# EAGLE design PCB SRCA (EAGLE 9.6.2)

## Sheet 1 of 3
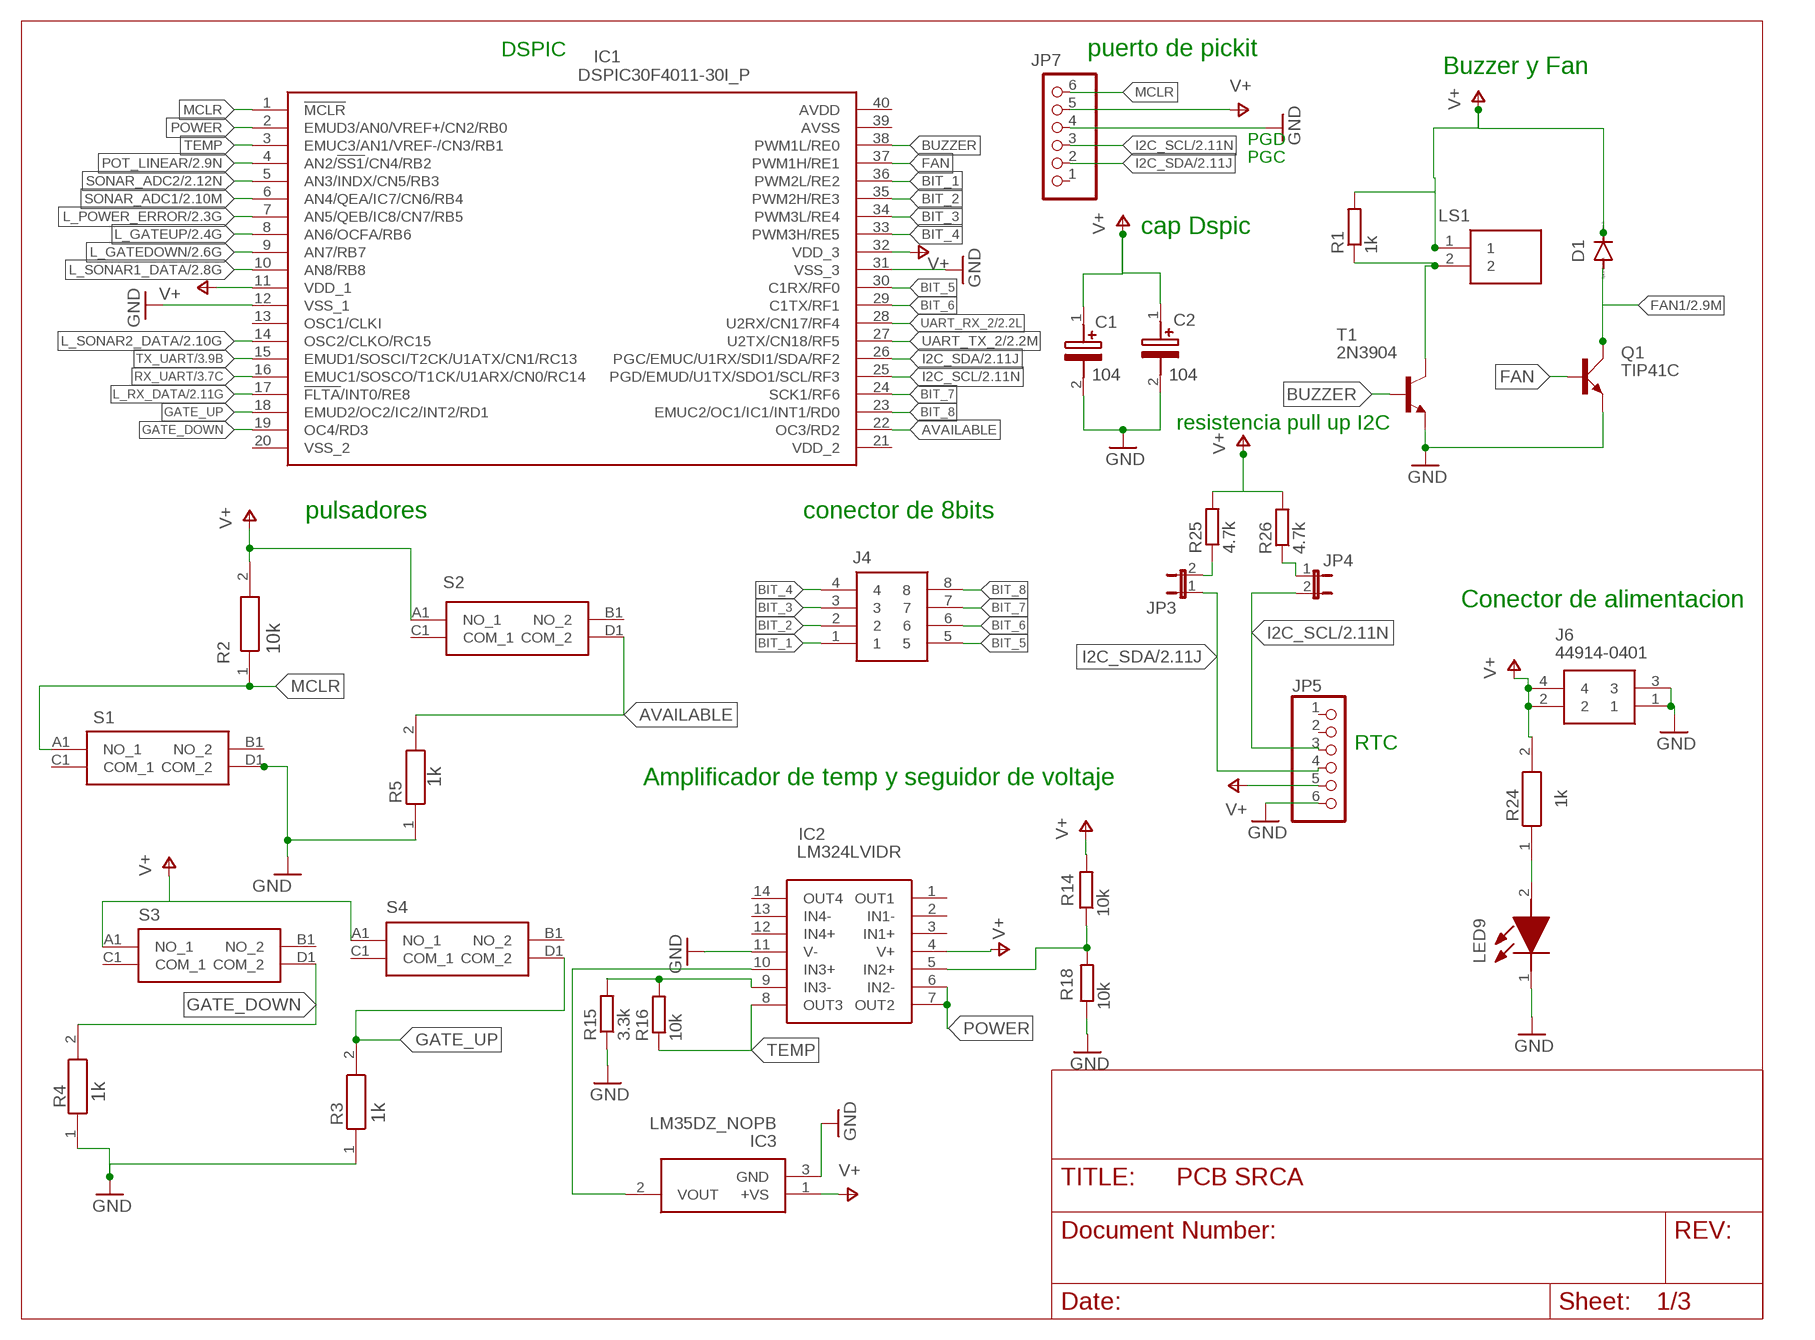
[diagram p0: schematic, sheet 1]

### Parts
C1  TAJR104K020RNJ  [CAPPM2014X120N]
C2  TAJR104K020RNJ  [CAPPM2014X120N]
D1  1N4148DO35-7  [DO35-7]
IC1  DSPIC30F4011-30I_P  [DIP1543W58P254L5175H635Q40N]
IC2  LM324LVIDR  [SOIC127P600X175-14N]
IC3  LM35DZ_NOPB  [LP0003A]
J4  44914-0801  [44914-0801]
J6  44914-0401  [44914-0401]
JP3  JP1E  [JP1]
JP4  JP1E  [JP1]
JP5  PINHD-1X6  [1X06]
JP7  PINHD-1X6  [1X06]
LED9  599-0181-007F  [LEDC2012X70N]
LS1  PS1240P02BT  [PS1240P02BT]
Q1  TIP41C  [TO220AV]
R1  1k  R-EU_0207/10  [0207/10]
R2  RC0805FR-071KL  [RESC2012X60N]
R3  RC0805FR-071KL  [RESC2012X60N]
R4  RC0805FR-071KL  [RESC2012X60N]
R5  RC0805FR-071KL  [RESC2012X60N]
R14  10k  R-EU_0207/10  [0207/10]
R15  3.3k  R-EU_0207/10  [0207/10]
R16  10k  R-EU_0207/10  [0207/10]
R18  10k  R-EU_0207/10  [0207/10]
R24  RC0805FR-071KL  [RESC2012X60N]
R25  4.7k  R-EU_0207/10  [0207/10]
R26  4.7k  R-EU_0207/10  [0207/10]
S1  PTS645SK50JSMTR92_LFS  [PTS645SK50JSMTR92LFS]
S2  PTS645SK50JSMTR92_LFS  [PTS645SK50JSMTR92LFS]
S3  PTS645SK50JSMTR92_LFS  [PTS645SK50JSMTR92LFS]
S4  PTS645SK50JSMTR92_LFS  [PTS645SK50JSMTR92LFS]
T1  2N3904  [TO92]

### Nets
AVAILABLE: IC1.22(OC3/RD2) R5.2 S2.D1(COM_2)
BIT_1: IC1.36(PWM2L/RE2) J4.1
BIT_2: IC1.35(PWM2H/RE3) J4.2
BIT_3: IC1.34(PWM3L/RE4) J4.3
BIT_4: IC1.33(PWM3H/RE5) J4.4
BIT_5: IC1.30(C1RX/RF0) J4.5
BIT_6: IC1.29(C1TX/RF1) J4.6
BIT_7: IC1.24(SCK1/RF6) J4.7
BIT_8: IC1.23(EMUC2/OC1/IC1/INT1/RD0) J4.8
BUZZER: IC1.38(PWM1L/RE0) T1.2(B)
FAN: IC1.37(PWM1H/RE1) Q1.B
FAN1: D1.A Q1.C ; also sheet 2
GATE_DOWN: IC1.19(OC4/RD3) R4.2 S3.D1(COM_2)
GATE_UP: IC1.18(EMUD2/OC2/IC2/INT2/RD1) R3.2 S4.D1(COM_2)
GND: C1.2(-) C2.2(-) IC1.12(VSS_1) IC1.31(VSS_3) IC2.11(V-) IC3.3(GND) J6.1 J6.3 JP5.6 JP7.4 LED9.1(K) Q1.E R3.1 R4.1 R5.1 R15.1 R18.1 S1.D1(COM_2) T1.3(E) ; also sheet 2,3
I2C_SCL: IC1.25(PGD/EMUD/U1TX/SDO1/SCL/RF3) JP4.2 JP5.3 JP7.3 ; also sheet 2
I2C_SDA: IC1.26(PGC/EMUC/U1RX/SDI1/SDA/RF2) JP3.1 JP5.4 JP7.2 ; also sheet 2
L_GATEDOWN: IC1.9(AN7/RB7) ; also sheet 2
L_GATEUP: IC1.8(AN6/OCFA/RB6) ; also sheet 2
L_POWER_ERROR: IC1.7(AN5/QEB/IC8/CN7/RB5) ; also sheet 2
L_RX_DATA: IC1.17(!FLTA!/INT0/RE8) ; also sheet 2
L_SONAR1_DATA: IC1.10(AN8/RB8) ; also sheet 2
L_SONAR2_DATA: IC1.14(OSC2/CLKO/RC15) ; also sheet 2
MCLR: IC1.1(!MCLR) JP7.6 R2.1 S1.A1(NO_1)
N$1: IC2.9(IN3-) R15.2 R16.2
N$14: IC2.10(IN3+) IC3.2(VOUT)
N$19: JP3.2 R25.1
N$25: LS1.2 R1.1 T1.1(C)
N$28: LED9.2(A) R24.1
N$31: JP4.1 R26.1
N$32: IC2.5(IN2+) R14.1 R18.2
POT_LINEAR: IC1.4(AN2/!SS1!/CN4/RB2) ; also sheet 2
POWER: IC1.2(EMUD3/AN0/VREF+/CN2/RB0) IC2.6(IN2-) IC2.7(OUT2)
RX_UART: IC1.16(EMUC1/SOSCO/T1CK/U1ARX/CN0/RC14) ; also sheet 3
SONAR_ADC1: IC1.6(AN4/QEA/IC7/CN6/RB4) ; also sheet 2
SONAR_ADC2: IC1.5(AN3/INDX/CN5/RB3) ; also sheet 2
TEMP: IC1.3(EMUC3/AN1/VREF-/CN3/RB1) IC2.8(OUT3) R16.1
TX_UART: IC1.15(EMUD1/SOSCI/T2CK/U1ATX/CN1/RC13) ; also sheet 3
UART_RX_2: IC1.28(U2RX/CN17/RF4) ; also sheet 2
UART_TX_2: IC1.27(U2TX/CN18/RF5) ; also sheet 2
V+: C1.1(+) C2.1(+) D1.C IC1.11(VDD_1) IC1.32(VDD_3) IC2.4(V+) IC3.1(+VS) J6.2 J6.4 JP5.5 JP7.5 LS1.1 R1.2 R2.2 R14.2 R24.2 R25.2 R26.2 S2.A1(NO_1) S3.A1(NO_1) S4.A1(NO_1) ; also sheet 2,3
Unconnected: IC1.13(OSC1/CLKI) IC1.20(VSS_2) IC1.21(VDD_2) IC1.39(AVSS) IC1.40(AVDD) IC2.1(OUT1) IC2.2(IN1-) IC2.3(IN1+) IC2.12(IN4+) IC2.13(IN4-) IC2.14(OUT4) JP5.1 JP5.2 JP7.1 S1.B1(NO_2) S1.C1(COM_1) S2.B1(NO_2) S2.C1(COM_1) S3.B1(NO_2) S3.C1(COM_1) S4.B1(NO_2) S4.C1(COM_1)

### Notes on the sheet
- DSPIC | puerto de pickit
- Buzzer y Fan
- PGD
- PGC
- cap Dspic
- 104 | 104
- resistencia pull up I2C
- pulsadores | conector de 8bits
- Conector de alimentacion
- 10k
- RTC
- 1k | Amplificador de temp y seguidor de voltaje
- 1k
- 1k
- 1k

## Sheet 2 of 3
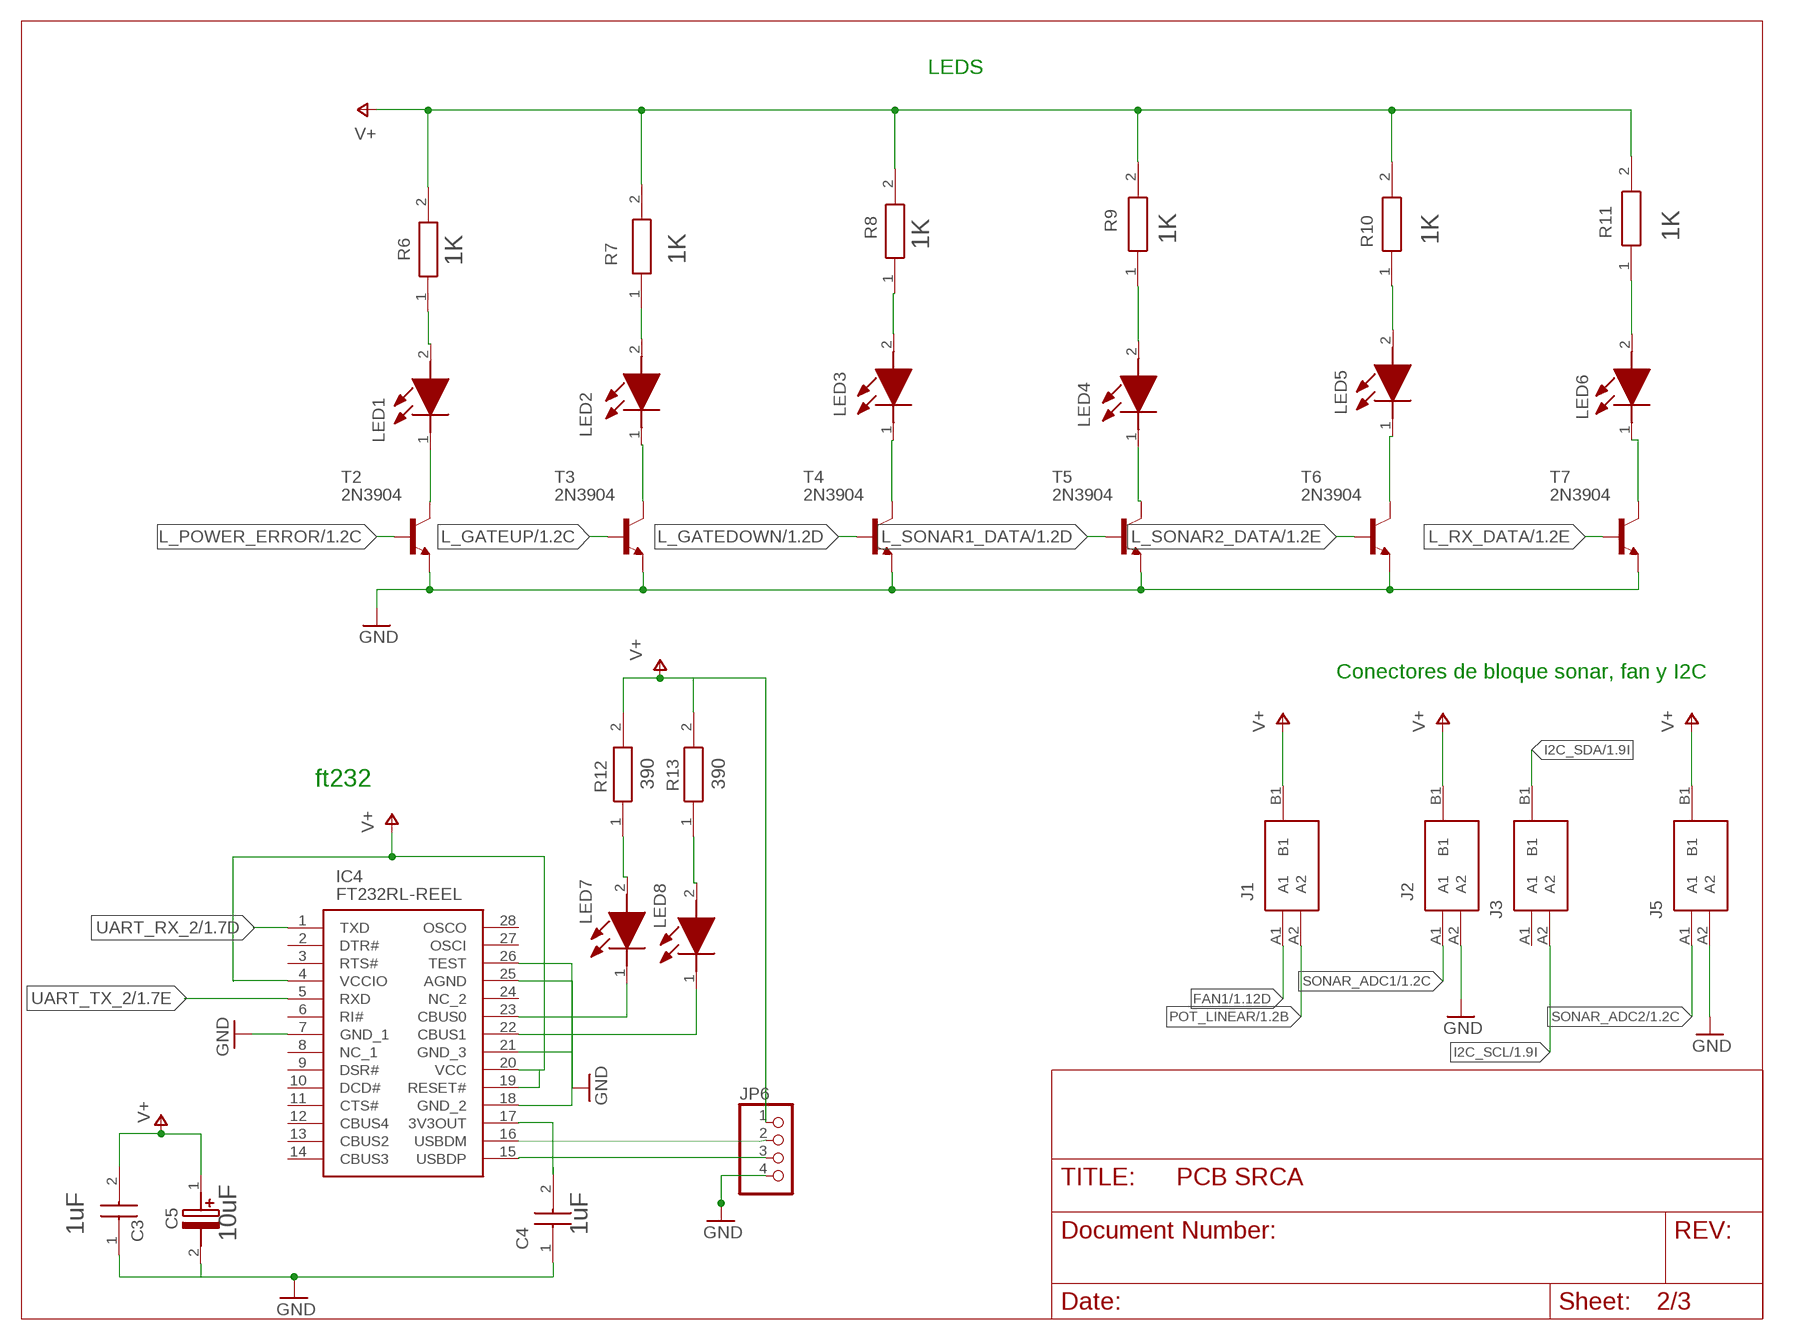
[diagram p1: schematic, sheet 2]

### Parts
C3  C0805X104K1RAC3316  [CAPC2012X100N]
C4  C0805X104K1RAC3316  [CAPC2012X100N]
C5  UUP1C100MCL1GS  [CAPAE530X610N]
IC4  FT232RL-REEL  [SOP65P778X200-28N]
J1  TBL002A-350-03GR-2OR  [TBL002A35003GR2OR]
J2  TBL002A-350-03GR-2OR  [TBL002A35003GR2OR]
J3  TBL002A-350-03GR-2OR  [TBL002A35003GR2OR]
J5  TBL002A-350-03GR-2OR  [TBL002A35003GR2OR]
JP6  PINHD-1X4  [1X04]
LED1  599-0181-007F  [LEDC2012X70N]
LED2  599-0181-007F  [LEDC2012X70N]
LED3  599-0181-007F  [LEDC2012X70N]
LED4  599-0181-007F  [LEDC2012X70N]
LED5  599-0181-007F  [LEDC2012X70N]
LED6  599-0181-007F  [LEDC2012X70N]
LED7  599-0181-007F  [LEDC2012X70N]
LED8  599-0181-007F  [LEDC2012X70N]
R6  RC0805FR-071KL  [RESC2012X60N]
R7  RC0805FR-071KL  [RESC2012X60N]
R8  RC0805FR-071KL  [RESC2012X60N]
R9  RC0805FR-071KL  [RESC2012X60N]
R10  RC0805FR-071KL  [RESC2012X60N]
R11  RC0805FR-071KL  [RESC2012X60N]
R12  RC0805FR-071KL  [RESC2012X60N]
R13  RC0805FR-071KL  [RESC2012X60N]
T2  2N3904  [TO92]
T3  2N3904  [TO92]
T4  2N3904  [TO92]
T5  2N3904  [TO92]
T6  2N3904  [TO92]
T7  2N3904  [TO92]

### Nets
FAN1: J1.A1 ; also sheet 1
GND: C3.1 C4.1 C5.2(-) IC4.7(GND_1) IC4.18(GND_2) IC4.21(GND_3) IC4.25(AGND) IC4.26(TEST) J2.A2 J5.A2 JP6.4 T2.3(E) T3.3(E) T4.3(E) T5.3(E) T6.3(E) T7.3(E) ; also sheet 1,3
I2C_SCL: J3.A2 ; also sheet 1
I2C_SDA: J3.B1 ; also sheet 1
L_GATEDOWN: T4.2(B) ; also sheet 1
L_GATEUP: T3.2(B) ; also sheet 1
L_POWER_ERROR: T2.2(B) ; also sheet 1
L_RX_DATA: T7.2(B) ; also sheet 1
L_SONAR1_DATA: T5.2(B) ; also sheet 1
L_SONAR2_DATA: T6.2(B) ; also sheet 1
N$2: LED1.2(A) R6.1
N$3: IC4.23(CBUS0) LED7.1(K)
N$4: LED1.1(K) T2.1(C)
N$5: LED2.2(A) R7.1
N$6: LED2.1(K) T3.1(C)
N$7: LED3.1(K) T4.1(C)
N$8: LED4.2(A) R9.1
N$9: LED5.2(A) R10.1
N$10: LED3.2(A) R8.1
N$11: LED4.1(K) T5.1(C)
N$12: LED6.2(A) R11.1
N$13: LED7.2(A) R12.1
N$15: LED8.2(A) R13.1
N$16: LED5.1(K) T6.1(C)
N$17: LED6.1(K) T7.1(C)
N$18: IC4.22(CBUS1) LED8.1(K)
N$20: C4.2 IC4.17(3V3OUT)
N$21: IC4.16(USBDM) JP6.2
N$22: IC4.15(USBDP) JP6.3
POT_LINEAR: J1.A2 ; also sheet 1
SONAR_ADC1: J2.A1 ; also sheet 1
SONAR_ADC2: J5.A1 ; also sheet 1
UART_RX_2: IC4.1(TXD) ; also sheet 1
UART_TX_2: IC4.5(RXD) ; also sheet 1
V+: C3.2 C5.1(+) IC4.4(VCCIO) IC4.19(RESET#) IC4.20(VCC) J1.B1 J2.B1 J5.B1 JP6.1 R6.2 R7.2 R8.2 R9.2 R10.2 R11.2 R12.2 R13.2 ; also sheet 1,3
Unconnected: IC4.2(DTR#) IC4.3(RTS#) IC4.6(RI#) IC4.8(NC_1) IC4.9(DSR#) IC4.10(DCD#) IC4.11(CTS#) IC4.12(CBUS4) IC4.13(CBUS2) IC4.14(CBUS3) IC4.24(NC_2) IC4.27(OSCI) IC4.28(OSCO) J3.A1

### Notes on the sheet
- LEDS
- 1K | 1K | 1K
- 1K
- 1K | 1K
- Conectores de bloque sonar, fan y I2C
- ft232 | 390 | 390
- 1uF | 10uF | 1uF

## Sheet 3 of 3
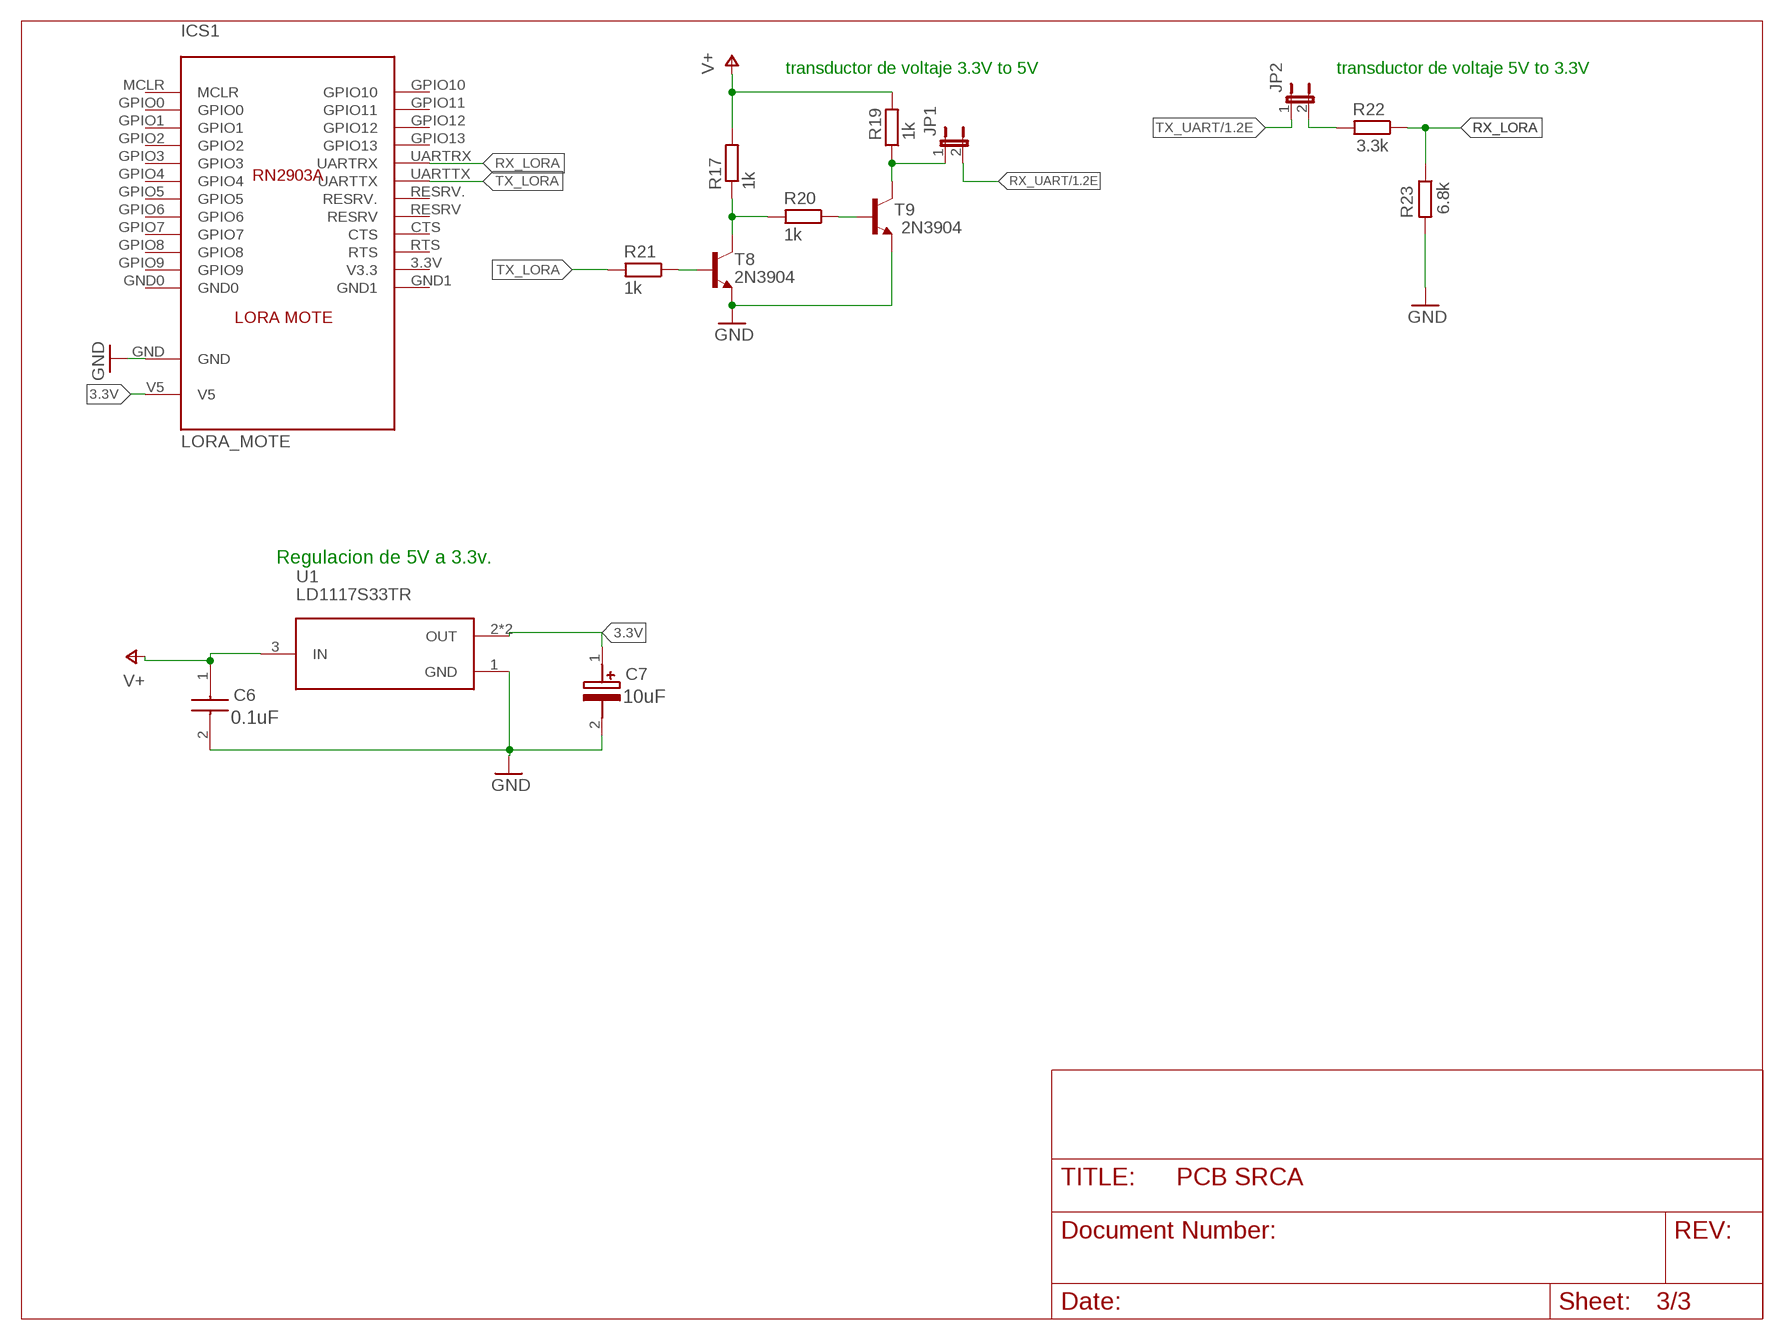
[diagram p2: schematic, sheet 3]

### Parts
C6  C0805X104K1RAC3316  [CAPC2012X100N]
C7  UUP1C100MCL1GS  [CAPAE530X610N]
ICS1  LORA_MOTE  [LORA_MOTE_RN2903]
JP1  JP1E  [JP1]
JP2  JP1E  [JP1]
R17  1k  R-EU_0207/10  [0207/10]
R19  1k  R-EU_0207/10  [0207/10]
R20  1k  R-EU_0207/10  [0207/10]
R21  1k  R-EU_0207/10  [0207/10]
R22  3.3k  R-EU_0207/10  [0207/10]
R23  6.8k  R-EU_0207/10  [0207/10]
T8  2N3904  [TO92]
T9  2N3904  [TO92]
U1  LD1117S33TR  [SOT230P700X180-4N]

### Nets
3.3V: C7.1(+) ICS1.V5 U1.2(OUT) U1.4(OUT)
GND: C6.2 C7.2(-) ICS1.GND R23.2 T8.3(E) T9.3(E) U1.1(GND) ; also sheet 1,2
N$23: R17.1 R20.2 T8.1(C)
N$24: R21.1 T8.2(B)
N$26: R20.1 T9.2(B)
N$27: JP2.2 R22.2
N$30: JP1.1 R19.1 T9.1(C)
RX_LORA: ICS1.UARTRX R22.1 R23.1
RX_UART: JP1.2 ; also sheet 1
TX_LORA: ICS1.UARTTX R21.2
TX_UART: JP2.1 ; also sheet 1
V+: C6.1 R17.2 R19.2 U1.3(IN) ; also sheet 1,2
Unconnected: ICS1.3.3V(V3.3) ICS1.CTS ICS1.GND0 ICS1.GND1 ICS1.GPIO0 ICS1.GPIO1 ICS1.GPIO2 ICS1.GPIO3 ICS1.GPIO4 ICS1.GPIO5 ICS1.GPIO6 ICS1.GPIO7 ICS1.GPIO8 ICS1.GPIO9 ICS1.GPIO10 ICS1.GPIO11 ICS1.GPIO12 ICS1.GPIO13 ICS1.MCLR ICS1.RESRV ICS1.RESRV. ICS1.RTS

### Notes on the sheet
- transductor de voltaje 3.3V to 5V | transductor de voltaje 5V to 3.3V
- Regulacion de 5V a 3.3v.
- 10uF
- 0.1uF

## Library data of the parts
C1 C2 = TAJR104K020RNJ:TAJR104K020RNJ: TAJ smt tant capacitor,case R,0.1uF,20V AVX 100nF SMD Solid MnO2 Tantalum Electrolytic Capacitor, 20 V dc +/-10%, TAJ Series Source: Datasheet; DESCRIPTION: TAJ smt tant capacitor,case R,0.1uF,20V AVX 100nF SMD Solid MnO2 Tantalum Electrolytic Capacitor, 20 V dc +/-10%, TAJ Series; HEIGHT: 1.2mm; MANUFACTURER_NAME: AVX; MANUFACTURER_PART_NUMBER: TAJR104K020RNJ; MOUSER_PART_NUMBER: 581-TAJR104K020R; MOUSER_PRICE-STOCK: https://www.mouser.co.uk/ProductDetail/AVX/TAJR104K020RNJ?qs=4whTb%2F0XQMhML1Gq%2FTLBlg%3D%3D
C3 C4 C6 = C0805X104K1RAC3316:C0805X104K1RAC3316: Multilayer Ceramic Capacitors MLCC - SMD/SMT 100V .1uF X7R AUTO 5mm Flex VW80808 Source: Datasheet <https://api.kemet.com/component-edge/download/datasheet/C0805X104K1RAC3316.pdf>; DESCRIPTION: Multilayer Ceramic Capacitors MLCC - SMD/SMT 100V .1uF X7R AUTO 5mm Flex VW80808; HEIGHT: 1mm; MANUFACTURER_NAME: Kemet; MANUFACTURER_PART_NUMBER: C0805X104K1RAC3316; MOUSER_PART_NUMBER: 80-C0805X104K1R3316; MOUSER_PRICE-STOCK: https://www.mouser.co.uk/ProductDetail/KEMET/C0805X104K1RAC3316/?qs=l7cgNqFNU1gwaeaoie4AnQ%3D%3D
C5 C7 = UUP1C100MCL1GS:UUP1C100MCL1GS: Aluminum Electrolytic Capacitors - SMD 16volts 10uF AEC-Q200 Source: Datasheet <https://componentsearchengine.com/Datasheets/1/UUP1C100MCL1GS.pdf>; DESCRIPTION: Aluminum Electrolytic Capacitors - SMD 16volts 10uF AEC-Q200; HEIGHT: 6.1mm; MANUFACTURER_NAME: Nichicon; MANUFACTURER_PART_NUMBER: UUP1C100MCL1GS; MOUSER_PART_NUMBER: 647-UUP1C100MCL1GS; MOUSER_PRICE-STOCK: http://www.mouser.com/Search/ProductDetail.aspx?qs=%252b5dlrCpRfH8DbZTiSmyuJw%3d%3d
D1 = diode:1N4148: DIODE high speed (Philips)
IC1 = DSPIC30F4011-30I_P:DSPIC30F4011-30I_P: Digital Signal Controllers Source: Datasheet <https://componentsearchengine.com/Datasheets/5/DSPIC30F4011-30I_P.pdf>; ARROW_PART_NUMBER: dsPIC30F4011-30I/P; ARROW_PRICE-STOCK: https://www.arrow.com/en/products/dspic30f4011-30ip/microchip-technology; DESCRIPTION: Digital Signal Controllers; HEIGHT: 6.35mm; MANUFACTURER_NAME: Microchip; MANUFACTURER_PART_NUMBER: DSPIC30F4011-30I/P; MOUSER_PART_NUMBER: 579-30F4011-30I/P; MOUSER_PRICE-STOCK: https://www.mouser.co.uk/ProductDetail/Microchip-Technology/dsPIC30F4011-30I-P?qs=nMCt4TBfEwpnzUUd8LIZNg%3D%3D
IC2 = LM324LVIDR:LM324LVIDR: 4-Channel Industry Standard Low Voltage Operational Amplifier Source: Datasheet <http://www.ti.com/lit/gpn/lm324lv>; ARROW_PART_NUMBER: LM324LVIDR; ARROW_PRICE-STOCK: https://www.arrow.com/en/products/lm324lvidr/texas-instruments; DESCRIPTION: 4-Channel Industry Standard Low Voltage Operational Amplifier; HEIGHT: 1.75mm; MANUFACTURER_NAME: Texas Instruments; MANUFACTURER_PART_NUMBER: LM324LVIDR; MOUSER_PART_NUMBER: 595-LM324LVIDR; MOUSER_PRICE-STOCK: https://www.mouser.co.uk/ProductDetail/Texas-Instruments/LM324LVIDR/?qs=qSfuJ%252Bfl%2Fd62Uwb7PBNJ4g%3D%3D
IC3 = LM35DZ_NOPB:LM35DZ_NOPB: +/-0.5C Temperature Sensor with Analog Output with 30V Capability Source: Datasheet <http://www.ti.com/lit/gpn/lm35>; DESCRIPTION: +/-0.5C Temperature Sensor with Analog Output with 30V Capability; HEIGHT: mm; MANUFACTURER_NAME: Texas Instruments; MANUFACTURER_PART_NUMBER: LM35DZ/NOPB; MOUSER_PART_NUMBER: 926-LM35DZ/NOPB; MOUSER_PRICE-STOCK: https://www.mouser.co.uk/ProductDetail/Texas-Instruments/LM35DZ-NOPB?qs=QbsRYf82W3F5RpWTxhXHxA%3D%3D
IC4 = FT232RL-REEL:FT232RL-REEL: USB/Serial IC UART SSOP-28 FTDI Chip FT232RL-REEL, USB Controller, 3MBd, USB 2.0, 1.8 5.25 V, 28-Pin SSOP Source: Datasheet <http://www.ftdichip.com/Support/Documents/DataSheets/ICs/DS_FT232R.pdf>; DESCRIPTION: USB/Serial IC UART SSOP-28 FTDI Chip FT232RL-REEL, USB Controller, 3MBd, USB 2.0, 1.8 5.25 V, 28-Pin SSOP; HEIGHT: 2mm; MANUFACTURER_NAME: FTDI Chip; MANUFACTURER_PART_NUMBER: FT232RL-REEL; MOUSER_PART_NUMBER: 895-FT232RL; MOUSER_PRICE-STOCK: https://www.mouser.co.uk/ProductDetail/FTDI/FT232RL-REEL?qs=D1%2FPMqvA103RC6OU6bKtoA%3D%3D
ICS1 = LORA_MOTE:LORA_MOTE
J1-J3 J5 = TBL002A-350-03GR-2OR:TBL002A-350-03GR-2OR: Fixed Terminal Blocks Terminal block, screwless, 3.50, 45, 3 poles, green w orange tab Source: Datasheet <https://www.mouser.fr/datasheet/2/670/tbl002a-350-1600859.pdf>; DESCRIPTION: Fixed Terminal Blocks Terminal block, screwless, 3.50, 45, 3 poles, green w orange tab; HEIGHT: 12.85mm; MANUFACTURER_NAME: CUI Inc.; MANUFACTURER_PART_NUMBER: TBL002A-350-03GR-2OR; MOUSER_PART_NUMBER: 490-TBL002A3503GR2OR; MOUSER_PRICE-STOCK: https://www.mouser.co.uk/ProductDetail/CUI-Devices/TBL002A-350-03GR-2OR?qs=PzGy0jfpSMsNR2AeoCll%252Bw%3D%3D
J4 = 44914-0801:44914-0801: Micro-Fit CPI Header, Compliant Pin Interface, Dual Row, Vertical, 8 Circuits, Tin (Sn) Plating, Glow-Wire Capable Source: Datasheet <https://www.molex.com/pdm_docs/sd/449140201_sd.pdf>; DESCRIPTION: Micro-Fit CPI Header, Compliant Pin Interface, Dual Row, Vertical, 8 Circuits, Tin (Sn) Plating, Glow-Wire Capable; HEIGHT: mm; MANUFACTURER_NAME: Molex; MANUFACTURER_PART_NUMBER: 44914-0801; MOUSER_PART_NUMBER: 538-44914-0801; MOUSER_PRICE-STOCK: https://www.mouser.co.uk/ProductDetail/Molex/44914-0801?qs=c7kbnNtxOmhgMCdedRAzWQ%3D%3D
J6 = 44914-0401:44914-0401: Micro-Fit CPI Header, Compliant Pin Interface, Dual Row, Vertical, 4 Circuits, Tin (Sn) Plating, Glow-Wire Capable Source: Datasheet <https://www.molex.com/pdm_docs/sd/449140201_sd.pdf>; DESCRIPTION: Micro-Fit CPI Header, Compliant Pin Interface, Dual Row, Vertical, 4 Circuits, Tin (Sn) Plating, Glow-Wire Capable; HEIGHT: mm; MANUFACTURER_NAME: Molex; MANUFACTURER_PART_NUMBER: 44914-0401; MOUSER_PART_NUMBER: 538-44914-0401; MOUSER_PRICE-STOCK: https://www.mouser.co.uk/ProductDetail/Molex/44914-0401?qs=A%252B%2FNCR0PvNXhdrzNhHXsvA%3D%3D
JP1-JP4 = jumper:JP1E: JUMPER
JP5 JP7 = pinhead:PINHD-1X6: PIN HEADER
JP6 = pinhead:PINHD-1X4: PIN HEADER
LED1-LED9 = 599-0181-007F:599-0181-007F: Standard LEDs - SMD SMD 0805 GREEN Source: Datasheet <http://www.mouser.com/datasheet/2/109/Dialight_CBI_data_599-0805_Apr2018-1370606.pdf>; DESCRIPTION: Standard LEDs - SMD SMD 0805 GREEN; HEIGHT: 0.7mm; MANUFACTURER_NAME: Dialight; MANUFACTURER_PART_NUMBER: 599-0181-007F; MOUSER_PART_NUMBER: 645-599-0181-007F; MOUSER_PRICE-STOCK: https://www.mouser.co.uk/ProductDetail/Dialight/599-0181-007F?qs=gTYE2QTfZfRUSax8JbgA2w%3D%3D
LS1 = PS1240P02BT:PS1240P02BT: Audio Indicators & Alerts Round 12.2mmx6.5mm 4kHz Vin=3V Source: Datasheet; DESCRIPTION: Audio Indicators & Alerts Round 12.2mmx6.5mm 4kHz Vin=3V; HEIGHT: mm; MANUFACTURER_NAME: TDK; MANUFACTURER_PART_NUMBER: PS1240P02BT; MOUSER_PART_NUMBER: 810-PS1240P02BT; MOUSER_PRICE-STOCK: https://www.mouser.co.uk/ProductDetail/TDK/PS1240P02BT?qs=d7g9p1yFhWaZXSY9MjKMkw%3D%3D
Q1 = transistor-power:TIP41C: NPN TRANSISTOR
R1 R14-R23 R25 R26 = rcl:R-EU_: RESISTOR, European symbol; SPICEPREFIX: R
R2-R13 R24 = RC0805FR-071KL:RC0805FR-071KL: GENERAL PURPOSE CHIP RESISTORS Source: Datasheet <http://www.yageo.com/documents/recent/PYu-RC_Group_51_RoHS_L_10.pdf>; DESCRIPTION: GENERAL PURPOSE CHIP RESISTORS; HEIGHT: 0.6mm; MANUFACTURER_NAME: YAGEO (PHYCOMP); MANUFACTURER_PART_NUMBER: RC0805FR-071KL; MOUSER_PART_NUMBER: 603-RC0805FR-071KL; MOUSER_PRICE-STOCK: https://www.mouser.co.uk/ProductDetail/Yageo/RC0805FR-071KL?qs=1ogmaHw32WJjeGY0DHXakQ%3D%3D
S1-S4 = Switche button:PTS645SK50JSMTR92_LFS: Tactile Switches 50mA 12VDC, SPST NO, 260 gf, 5.0mm H, SMT J-type Source: Datasheet <https://www.digikey.in/product-detail/en/c-k/PTS645SK50JSMTR92-LFS/108-PTS645SK50JSMTR92LFSCT-ND/12163485>; DESCRIPTION: Tactile Switches 50mA 12VDC, SPST NO, 260 gf, 5.0mm H, SMT J-type; HEIGHT: 5mm; MANUFACTURER_NAME: C & K COMPONENTS; MANUFACTURER_PART_NUMBER: PTS645SK50JSMTR92 LFS; MOUSER_PART_NUMBER: 611-SK50JSMTR92LFS; MOUSER_PRICE-STOCK: https://www.mouser.co.uk/ProductDetail/CK/PTS645SK50JSMTR92-LFS?qs=TiOZkKH1s2Tk7%252B%2Fs4hXb%252Bw%3D%3D
T1-T9 = transistor-neu-to92:2N3904: NPN TRANSISTOR
U1 = LD1117S33TR:LD1117S33TR: LDO Voltage Regulators 3.3V 0.8A Positive Check prices <https://pricing.snapeda.com/parts/LD1117S33TR/STMicroelectronics/view-part?ref=eda>; AVAILABILITY: In Stock; DESCRIPTION: Linear Voltage Regulator IC Positive Fixed 1 Output 800mA SOT-223; MF: STMicroelectronics; MP: LD1117S33TR; PACKAGE: SOT-223 STMicroelectronics; PRICE: None; PURCHASE-URL: https://pricing.snapeda.com/search/part/LD1117S33TR/?ref=eda

## Board
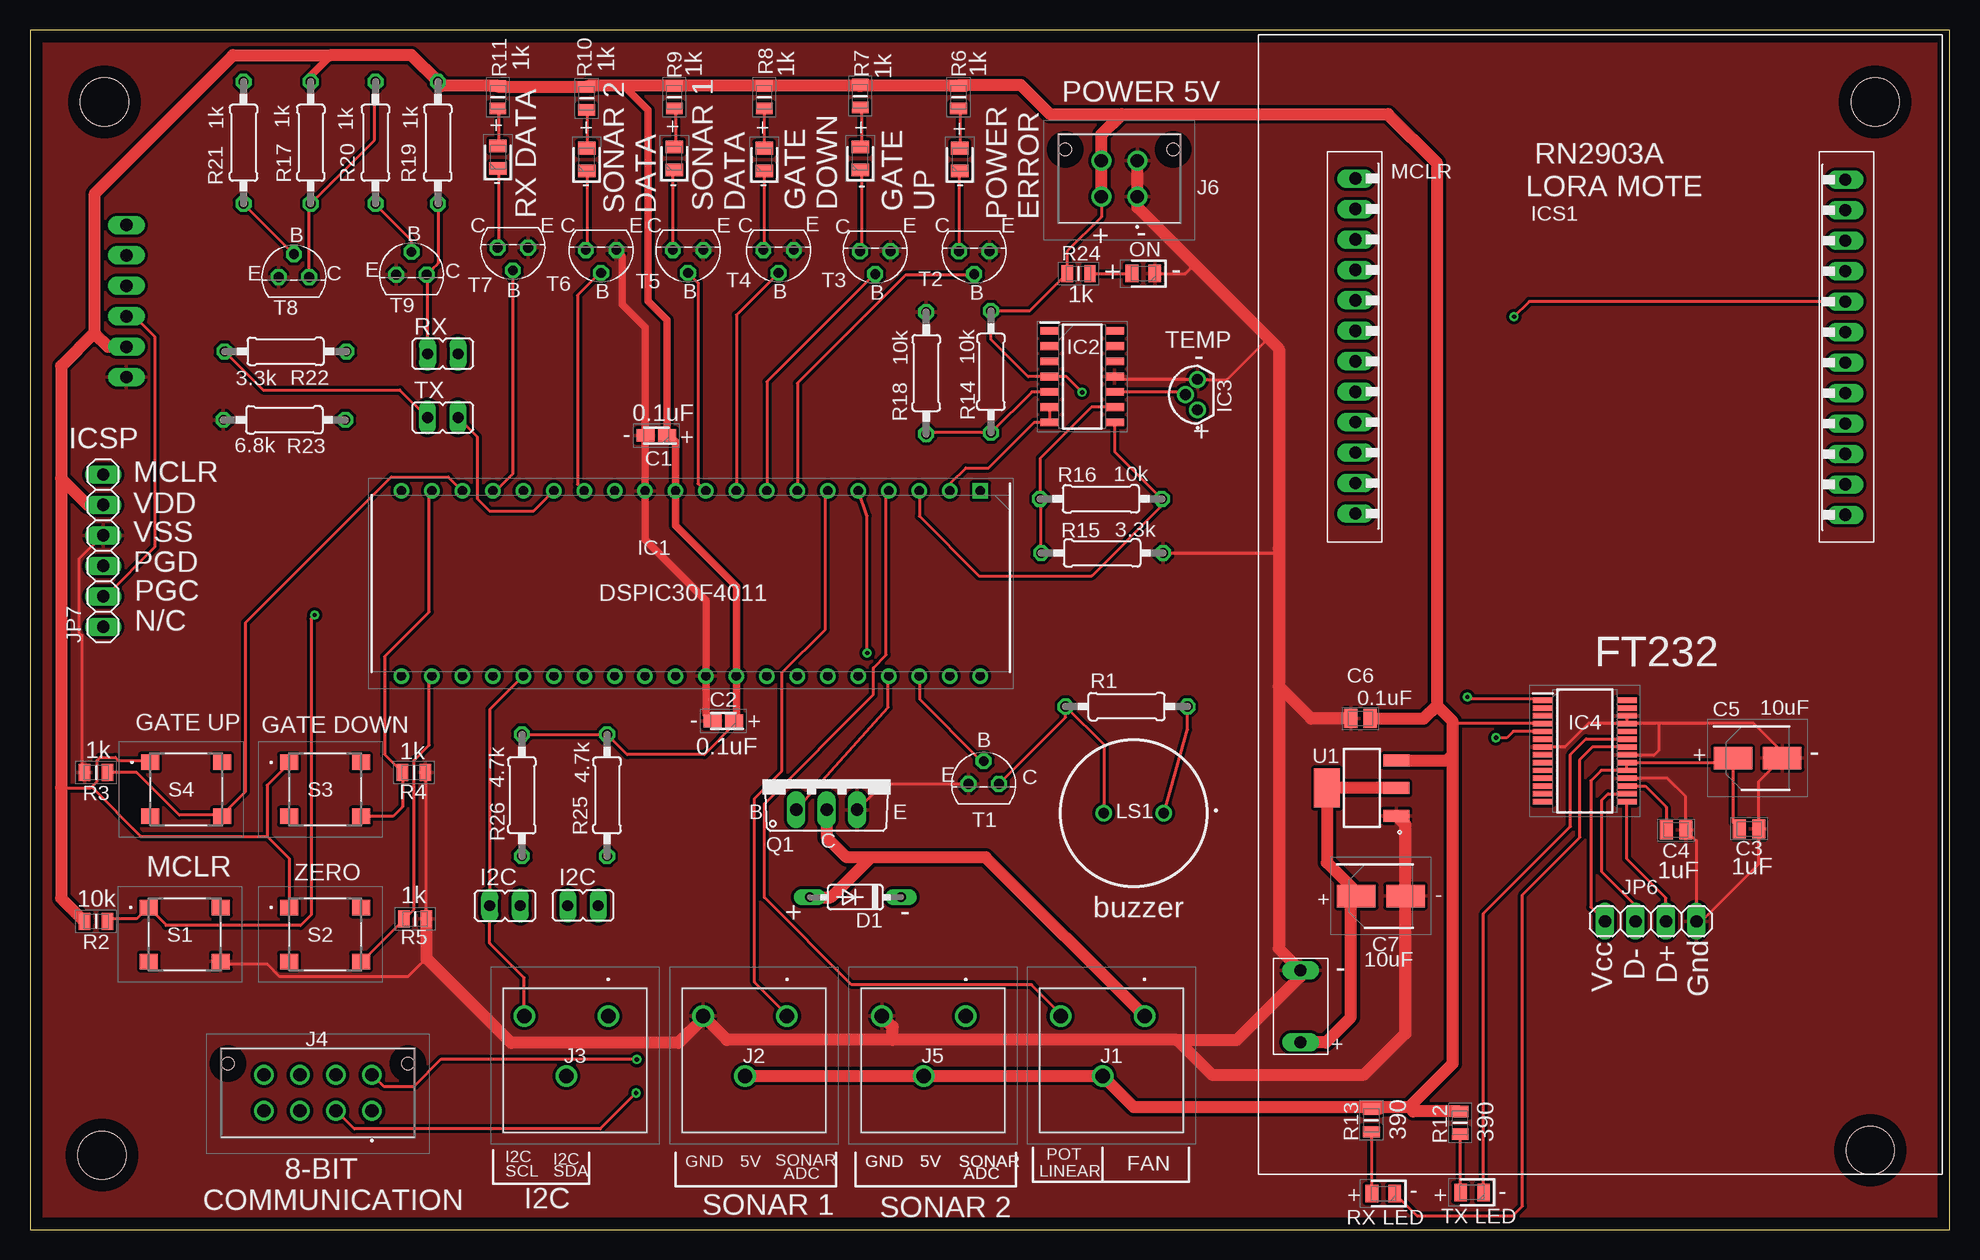
[diagram p3: board, top side]
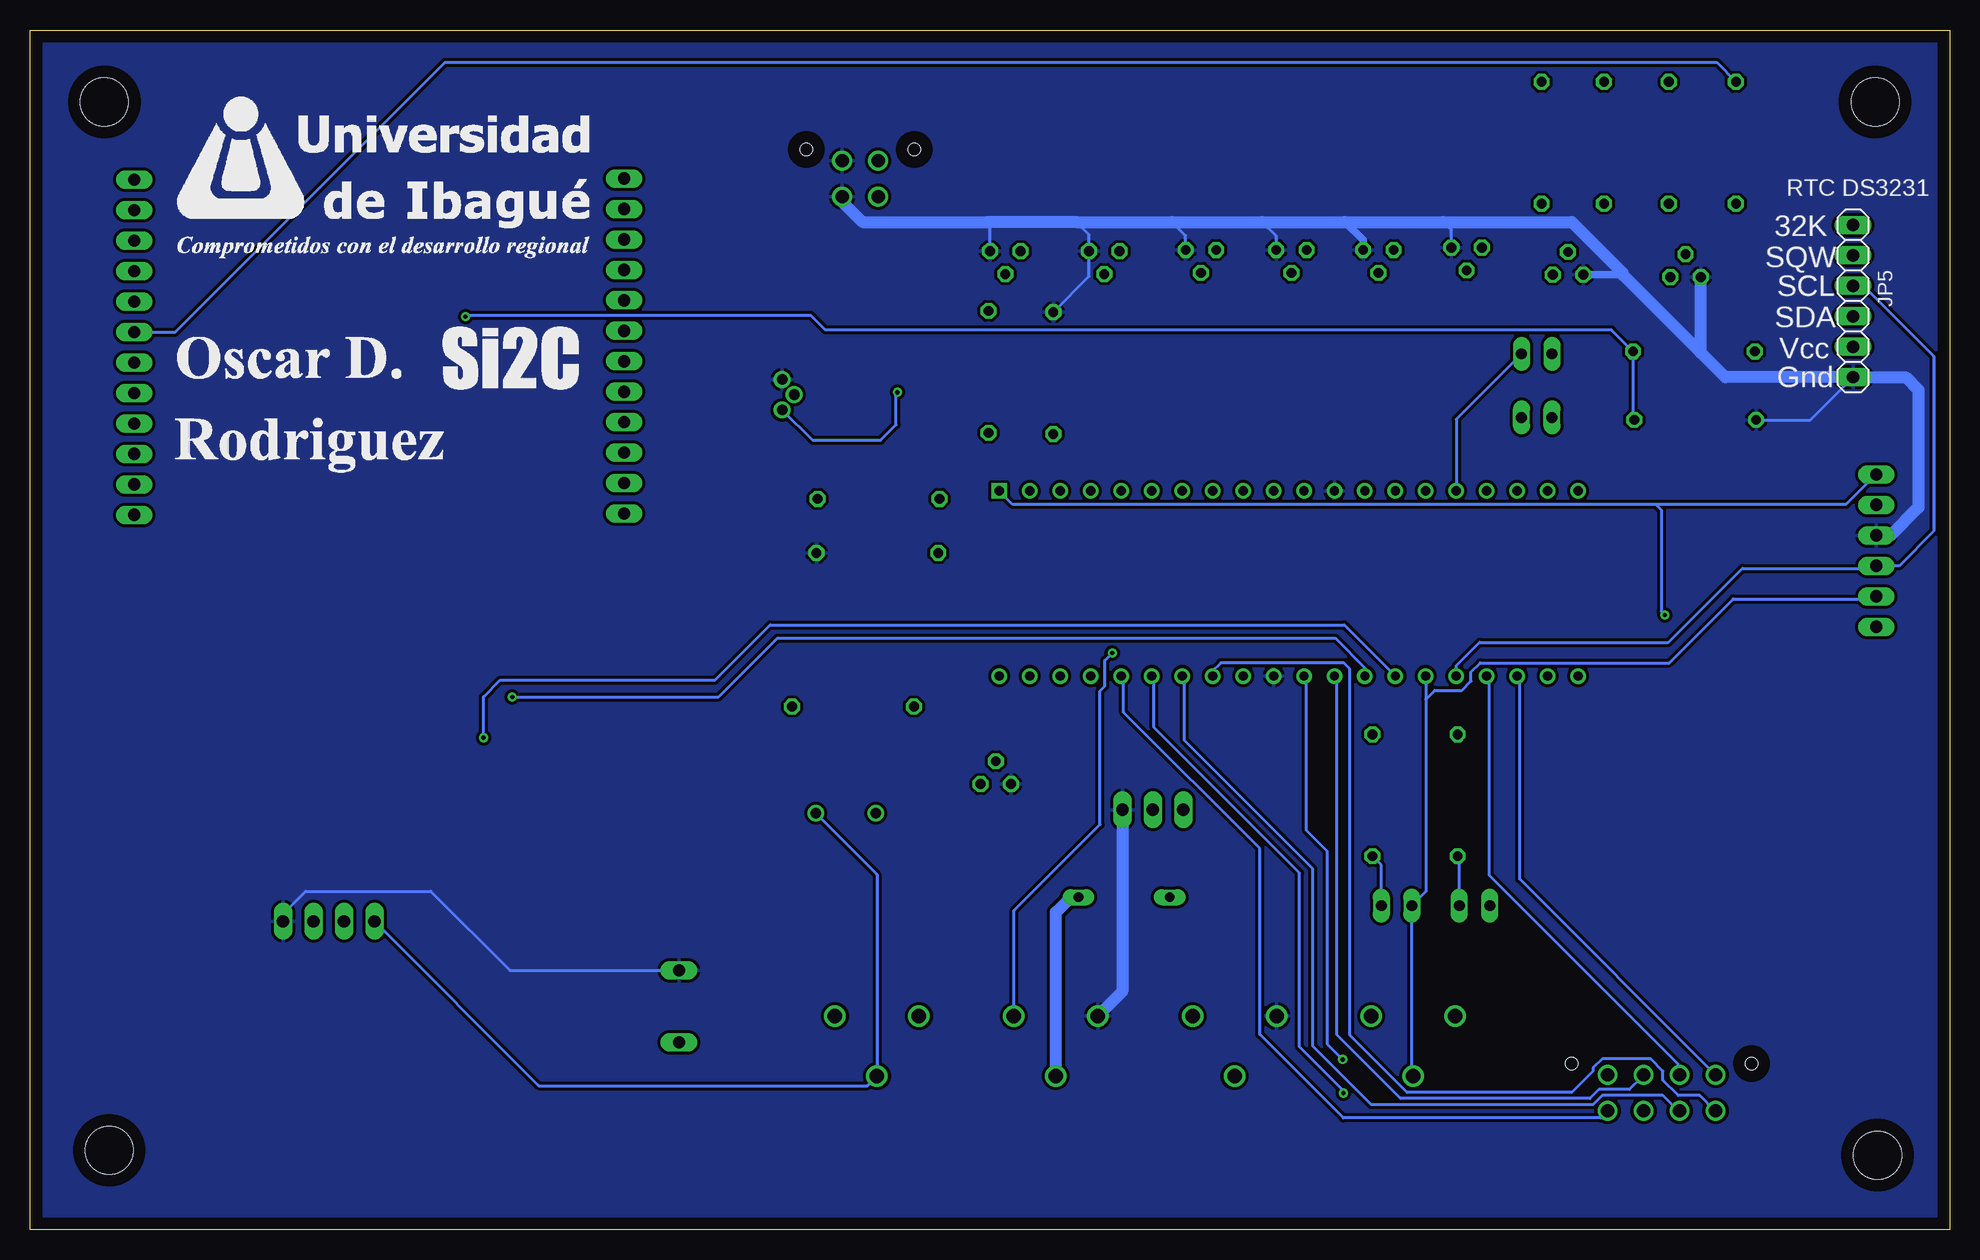
[diagram p4: board, bottom side, seen from below]

Size 160 x 100 mm. Coordinates in mm from the lower left corner, seen from the top.
Outline: 0,100 0,0 160,0 160,100 0,100
Copper layers (1*16): Top 0.035mm / dielectric 1.5mm / Bottom 0.035mm
Design rules "default *": minimum track width 10mil, minimum drill 0.35mm, track to track 10mil, track to pad 6mil, pad to pad 6mil, via to via 10mil, smd to smd 10mil, copper to edge 40mil, drill to drill 8mil, minimum pad ring 10mil, minimum via ring 8mil, stop-mask expansion 4mil, vias tented up to drill 0mil, thermal gap 10mil
Holes 4 mm at 6,6.2 6.2,94 153.8,94 153.4,6.6

### Footprints (pad centres in the part's own frame; a part is rotated, then mirrored left to right if it is on the bottom)
CAPPM2014X120N = smd 1.5 x 1.05: 1 -0.9,0; 2 0.9,0
CAPC2012X100N = smd 1.1 x 1.57: 1 -0.81,0; 2 0.81,0
CAPAE530X610N = smd 3.2 x 1.85: 1 -2.05,0; 2 2.05,0
DO35-7 = drill 0.813 long: A 3.81,0; C -3.81,0
DIP1543W58P254L5175H635Q40N = drill 0.784 pad 1.184 square: 1 -7.715,24.13 | drill 0.784 pad 1.184: 2 -7.715,21.59; 3 -7.715,19.05; 4 -7.715,16.51; 5 -7.715,13.97; 6 -7.715,11.43; 7 -7.715,8.89; 8 -7.715,6.35; 9 -7.715,3.81; 10 -7.715,1.27; 11 -7.715,-1.27; 12 -7.715,-3.81; 13 -7.715,-6.35; 14 -7.715,-8.89; 15 -7.715,-11.43; 16 -7.715,-13.97; 17 -7.715,-16.51; 18 -7.715,-19.05; 19 -7.715,-21.59; 20 -7.715,-24.13; 21 7.715,-24.13; 22 7.715,-21.59; 23 7.715,-19.05; 24 7.715,-16.51; 25 7.715,-13.97; 26 7.715,-11.43; 27 7.715,-8.89; 28 7.715,-6.35; 29 7.715,-3.81; 30 7.715,-1.27; 31 7.715,1.27; 32 7.715,3.81; 33 7.715,6.35; 34 7.715,8.89; 35 7.715,11.43; 36 7.715,13.97; 37 7.715,16.51; 38 7.715,19.05; 39 7.715,21.59; 40 7.715,24.13
SOIC127P600X175-14N = smd 1.525 x 0.65: 1 -2.712,3.81; 2 -2.712,2.54; 3 -2.712,1.27; 4 -2.712,0; 5 -2.712,-1.27; 6 -2.712,-2.54; 7 -2.712,-3.81; 8 2.712,-3.81; 9 2.712,-2.54; 10 2.712,-1.27; 11 2.712,0; 12 2.712,1.27; 13 2.712,2.54; 14 2.712,3.81
LP0003A = drill 0.9 pad 1.4: 1 -1.27,-1; 2 0,0; 3 1.27,-1
SOP65P778X200-28N = smd 1.7 x 0.45: 1 -3.5,4.225; 2 -3.5,3.575; 3 -3.5,2.925; 4 -3.5,2.275; 5 -3.5,1.625; 6 -3.5,0.975; 7 -3.5,0.325; 8 -3.5,-0.325; 9 -3.5,-0.975; 10 -3.5,-1.625; 11 -3.5,-2.275; 12 -3.5,-2.925; 13 -3.5,-3.575; 14 -3.5,-4.225; 15 3.5,-4.225; 16 3.5,-3.575; 17 3.5,-2.925; 18 3.5,-2.275; 19 3.5,-1.625; 20 3.5,-0.975; 21 3.5,-0.325; 22 3.5,0.325; 23 3.5,0.975; 24 3.5,1.625; 25 3.5,2.275; 26 3.5,2.925; 27 3.5,3.575; 28 3.5,4.225
LORA_MOTE_RN2903 = drill 1.016 long: 3.3V 19.92,3.52; CTS 19.92,8.6; GND0 -20.92,1.08; GND1 19.92,0.98; GPIO0 -20.92,26.48; GPIO1 -20.92,23.94; GPIO2 -20.92,21.4; GPIO3 -20.92,18.86; GPIO4 -20.92,16.32; GPIO5 -20.92,13.78; GPIO6 -20.92,11.24; GPIO7 -20.92,8.7; GPIO8 -20.92,6.16; GPIO9 -20.92,3.62; GPIO10 19.92,28.92; GPIO11 19.92,26.38; GPIO12 19.92,23.84; GPIO13 19.92,21.3; MCLR -20.92,29.02; RESRV 19.92,11.14; RESRV. 19.92,13.68; RTS 19.92,6.06; UARTRX 19.92,18.76; UARTTX 19.92,16.22 | drill 1.03 long: GND -25.5,-37; V5 -25.5,-43
TBL002A35003GR2OR = drill 1.2 pad 1.8: A1 0,0; A2 7,0; B1 3.5,5
44914-0801 = drill 1.11 pad 1.65: 1 0,0; 2 -3,0; 3 -6,0; 4 -9,0; 5 0,3; 6 -3,3; 7 -6,3; 8 -9,3 | hole 1.02: 3,3.94; -12,3.94
44914-0401 = drill 1.11 pad 1.65: 1 0,0; 2 -3,0; 3 0,3; 4 -3,3 | hole 1.02: 3,3.94; -6,3.94
JP1 = drill 0.914 long: 1 0,-1.27; 2 0,1.27
1X06 = drill 1.016 long: 1 -6.35,0; 2 -3.81,0; 3 -1.27,0; 4 1.27,0; 5 3.81,0; 6 6.35,0
1X04 = drill 1.016 long: 1 -3.81,0; 2 -1.27,0; 3 1.27,0; 4 3.81,0
LEDC2012X70N = smd 1.05 x 1.45: 1 -0.95,0; 2 0.95,0
PS1240P02BT = drill 0.85 pad 1.35: 1 0,2.5; 2 0,-2.5
TO220AV = drill 1.016 long: B -2.54,-2.54; C 0,-2.54; E 2.54,-2.54
0207/10 = drill 0.813 octagon: 1 -5.08,0; 2 5.08,0
RESC2012X60N = smd 0.95 x 1.4: 1 -0.95,0; 2 0.95,0
PTS645SK50JSMTR92LFS = smd 1.5 x 1.3: A1 -3,2.25; B1 3,2.25; C1 -3,-2.25; D1 3,-2.25
TO92 = drill 0.813 octagon: 1 1.27,0; 2 0,1.905; 3 -1.27,0
SOT230P700X180-4N = smd 2.15 x 1: 1 -2.9,2.3; 2 -2.9,0; 3 -2.9,-2.3 | smd 2.15 x 3.25: 4 2.9,0

### Placement (x,y rotation side)
C1  52.2,66.2 180 top
C2  57.8,42.4 180 top
C3  143.3,33.4 180 top
C4  137.2,33.3 180 top
C5  144,39.3 0 top
C6  110.9,42.6 180 top
C7  112.6,27.8 0 top
D1  68.8,27.7 180 top
IC1  55.08,53.86 270 top
IC2  87.7,71.1 0 top
IC3  96.3,69.6 90 top
IC4  129.6,39.9 0 top
ICS1  131.4,58.6 0 top
J1  92.9,17.8 180 top
J2  63.1,17.8 180 top
J3  48.2,17.8 180 top
J4  28.5,9.9 0 top
J5  78,17.8 180 top
J6  92.3,86.1 0 top
JP1  34.4,73 270 top
JP2  34.4,67.7 90 top
JP3  46.1,27 270 top
JP4  39.6,27 90 top
JP5  8.04,77.4 270 bottom
JP6  135.1,25.7 0 top
JP7  6.1,56.6 90 top
LED1  77.5,89.2 90 top
LED2  69.2,89.3 90 top
LED3  61.2,89.2 90 top
LED4  53.7,89.3 90 top
LED5  46.4,89.2 90 top
LED6  39,89.4 90 top
LED7  120.2,3.1 180 top
LED8  112.8,3 180 top
LED9  92.8,79.7 180 top
LS1  92,34.7 270 top
Q1  66.41,37.54 0 top
R1  91.4,43.6 0 top
R2  5.5,25.7 180 top
R3  5.5,38.1 0 top
R4  32,38.1 180 top
R5  32.1,25.9 180 top
R6  77.4,94.4 90 top
R7  69.2,94.5 90 top
R8  61.2,94.4 90 top
R9  53.7,94.4 90 top
R10  46.4,94.3 90 top
R11  39,94.4 90 top
R12  119.2,8.9 90 top
R13  111.8,9.1 90 top
R14  80.1,71.5 90 top
R15  89.37,56.4 180 top
R16  89.27,60.91 180 top
R17  23.4,90.6 90 top
R18  74.7,71.4 270 top
R19  34,90.6 90 top
R20  28.8,90.6 90 top
R21  17.8,90.6 90 top
R22  21.3,73.2 180 top
R23  21.2,67.5 180 top
R24  87.4,79.7 180 top
R25  48.1,36.2 90 top
R26  41,36.2 90 top
S1  12.9,24.6 0 top
S2  24.6,24.6 0 top
S3  24.6,36.7 0 top
S4  13,36.7 0 top
T1  79.49,37.14 0 top
T2  78.7,81.56 180 top
T3  70.45,81.56 180 top
T4  62.4,81.66 180 top
T5  54.85,81.66 180 top
T6  47.6,81.66 180 top
T7  40.25,81.86 180 top
T8  22,79.4 0 top
T9  31.8,79.6 0 top
U1  111,36.8 180 top

### Tracks (layer width: path | path; a pad name or v marks a point on that pad's centre or on a via)
3.3V
  Top 1.016: U1.2 U1.4 108.1,30.6 110.55,28.15 C7.1 110.1,27.35 110.1,17.7 108,15.6 ICS1.V5
AVAILABLE
  Top 0.254: S2.D1 27.69,22.35 30.99,25.65 R5.2 31.24,25.91 32,26.67 32,39.12 33.27,40.39 33.27,45.97 IC1.22
BIT_1
  Bottom 0.254: J4.1 29.09,9.31 50.53,9.31 57.49,16.26 57.49,31.77 68.83,43.12 68.83,45.97 IC1.36
BIT_2  (via drill 0.35)
  Top 0.254: v50.53,11.38 47.53,8.38 27.02,8.38 J4.2
  Bottom 0.254: v50.53,11.38 50.53,11.58 54.18,15.22 54.18,29.72 66.29,41.84 66.29,45.97 IC1.35
BIT_3
  Bottom 0.254: IC1.34 63.75,45.97 63.75,40.76 53.07,30.08 53.07,15.29 48.2,10.41 29.72,10.41 28.96,11.18 23.88,11.18 22.61,9.91 J4.3
BIT_4
  Bottom 0.254: IC1.33 61.43,46.55 60.74,47.24 50.5,47.24 49.98,46.73 49.98,16.2 45.21,11.43 31.5,11.43 29.72,13.21 29.72,13.46 28.96,14.22 24.89,14.22 23.88,13.21 23.88,12.45 22.61,11.18 20.83,11.18 19.56,9.91 J4.4
BIT_5  (via drill 0.35)
  Top 0.254: v50.58,14.17 45.27,14.17 45.21,14.22 34.29,14.22 32,11.94 29.46,11.94 28.7,12.7 J4.5
  Bottom 0.254: v50.58,14.17 51.86,15.45 51.86,31.53 53.59,33.26 53.59,45.97 IC1.30
BIT_6
  Bottom 0.254: IC1.29 51.05,45.97 51.05,16.21 45.77,10.92 29.97,10.92 29.21,11.68 26.67,11.68 25.65,12.7 J4.6
BIT_7
  Bottom 0.254: IC1.24 38.35,45.97 38.35,29.52 22.61,13.77 22.61,12.95 J4.7
BIT_8
  Bottom 0.254: IC1.23 35.81,45.97 35.81,29.21 19.56,12.95 J4.8
BUZZER
  Top 0.254: IC1.38 74.17,45.97 74.17,44.2 79.25,39.12 T1.2
FAN
  Top 0.254: Q1.B 71.53,43.52 71.53,46.08 IC1.37
FAN1
  Top 1.016: J1.A1 79.67,31.04 70.1,31.04 | Q1.C 66.41,32.69 68.06,31.04 70.1,31.04 | 70.1,31.04 66.77,27.7 D1.A
GATE_DOWN
  Top 0.254: IC1.19 33.27,61.47 33.27,51.5 29.54,47.77 29.54,39.61 R4.2 31.05,35.25 30.25,34.45 S3.D1
GATE_UP
  Top 0.254: R3.2 8.89,38.1 12.45,34.54 15.75,34.54 S4.D1 16,34.54 17.97,36.51 17.97,50.59 30.12,62.74 34.87,62.74 IC1.18
GND
  Top 0.254: Q1.E 71.09,37.14 T1.3 | IC4.26 IC4.25 | IC4.25 129.88,42.17 127.92,40.23 IC4.7 | IC4.18 136.47,37.62 138.01,36.09 C4.1 138.91,32.4 JP6.4 139.31,25.7 144.11,30.5 C3.1 144.11,37.36 C5.2 146.05,39.8 143.68,42.17 135.8,42.17 | 135.8,42.17 IC4.25 | LED9.1 96.3,79.7 97.06,80.46 | R3.1 4.32,38.1 4.32,49.53 4.06,49.78 4.06,55.88 6.1,57.91 JP7.4 | R4.1 33.02,38.1 33.02,26.16 R5.1 | S1.D1 16,22.1 19.81,22.1 20.83,21.08 31.5,21.08 32.77,22.35 33.05,22.6 | 51.27,66.04 51.31,66.04 C1.2 | IC4.21 135.38,39.58 135.8,40 135.8,42.17 | R15.1 103.7,56.4 104.1,56.8 | IC2.11 90.64,70.87 IC3.3 99.77,70.87 103.21,74.31
  Top 0.61: C2.2 56.35,42.95 IC1.31 56.35,52.45 51.27,57.53 IC1.12 51.27,66.04 51.27,75.24 49.37,77.14 49.37,81.16 T6.3
  Top 1.016: 95.6,15.8 100.6,15.8 105.9,21.1 ICS1.GND 104.1,23.4 104.1,45.3 | 95.6,15.8 71.9,15.8 | 71.9,15.8 58.1,15.8 J2.A2 56.1,17.56 54.08,15.54 40.11,15.54 33.05,22.6 R5.1 | J6.3 J6.1 92.3,85.22 97.06,80.46 103.21,74.31 104.1,73.42 104.1,56.8 104.1,45.3 | 71.9,15.8 71.9,16.9 J5.A2 | U1.1 114.65,33.75 C7.2 114.65,16.35 111.2,12.9 98.5,12.9 95.6,15.8 | C6.2 106.8,42.6 104.1,45.3
  Bottom 0.254: T2.3 79.97,83.77 80.2,84 | T7.3 41.52,83.32 42.2,84 | T5.3 56.12,82.82 57.3,84 | T4.3 63.67,82.87 64.8,84 | 72.8,84 71.72,82.92 T3.3 71.72,79.46 R18.1 | R23.2 11.59,67.5 JP5.6 | JP6.4 138.91,26.3 137.01,28.2 126.6,28.2 120,21.6 ICS1.GND
  Bottom 0.61: T6.3 48.87,82.47 50.4,84 | T9.3 27.23,79.6 27.23,79.73
  Bottom 1.016: 20.73,73.1 T8.3 | 20.73,73.1 18.68,71.05 JP5.6 3.65,71.05 2.6,70 2.6,60.17 4.9,57.87 JP7.4 | 20.73,73.1 27.23,79.6 | 27.23,79.73 31.5,84 42.2,84 50.4,84 57.3,84 64.8,84 72.8,84 80.2,84 90.6,84 92.3,85.7 J6.1 | Q1.E 68.95,19.85 J5.A2
  pour Bottom: 0,100 0,0 160,0 160,100
  pour Top: 0,100 0,0 160,0 160,100
I2C_SCL
  Top 0.254: J3.A2 41.2,21 38.33,23.87 JP4.2 38.33,43.37 IC1.25
  Bottom 0.254: IC1.25 41.11,47.01 39.17,48.95 23.42,48.95 17.26,55.12 6.35,55.12 JP7.3 4.21,55.33 1.32,58.22 1.32,72.8 7.19,78.67 JP5.3
I2C_SDA
  Top 0.254: JP7.2 6.35,52.83 10.41,56.9 10.41,74.42 8.71,76.13 JP5.4
  Bottom 0.254: IC1.26 43.65,44.2 | J3.B1 44.8,12.9 44.8,26.97 JP3.1 43.65,28.18 43.65,44.2 | JP7.2 6.35,52.58 18.03,52.58 23.37,47.24 39.12,47.24 39.88,46.48 39.88,45.72 40.64,44.96 42.9,44.96 42.9,44.95 43.65,44.2
L_GATEDOWN
  Top 0.254: T4.2 62.31,79.65 58.89,76.23 IC1.9
L_GATEUP
  Top 0.254: T3.2 70.31,79.55 61.43,70.67 IC1.8
L_POWER_ERROR
  Top 0.254: T2.2 78.51,79.55 72.97,79.55 63.97,70.56 IC1.7
L_RX_DATA
  Top 0.254: T7.2 40.25,63.26 40.23,63.2 40.23,62.99 38.82,61.58 IC1.17
L_SONAR1_DATA
  Top 0.254: T5.2 55.69,78.92 55.69,62.23 55.68,62.18 56.28,61.58 IC1.10
L_SONAR2_DATA
  Top 0.254: T6.2 47.4,79.65 45.63,77.88 45.63,62.13 IC1.14
MCLR  (via drill 0.35)
  Top 0.254: R2.1 6.6,25.91 8.89,25.91 9.65,26.67 S1.A1 11.34,25.41 11.34,25.35 22.55,25.35 23.42,26.22 23.42,50.92 v23.72,51.22
  Bottom 0.254: IC1.1 78.09,60.45 24.47,60.45 | 24.47,60.45 8.64,60.45 6.14,62.95 JP7.6 | v23.72,51.22 24.02,51.52 24.02,60 24.47,60.45
N$1
  Top 0.254: IC2.9 88.46,68.56 84.19,64.29 R16.2 84.29,60.81 R15.2
N$2
  Top 0.254: R6.1 77.5,93.35 LED1.2
N$3
  Top 0.254: IC4.23 133.07,40.9 129.7,40.9 128.4,39.6 128.4,33.6 121.15,26.35 LED7.1
N$4
  Top 0.254: LED1.1 77.47,88.14 77.47,81.79 T2.1
N$5
  Top 0.254: R7.1 69.34,93.47 69.34,90.42 LED2.2
N$6
  Top 0.254: LED2.1 69.34,88.14 69.34,81.79 T3.1
N$7
  Top 0.254: LED3.1 61.21,88.14 61.21,81.79 T4.1
N$8
  Top 0.254: R9.1 53.85,93.22 53.85,90.42 LED4.2
N$9
  Top 0.254: R10.1 46.48,93.22 46.48,90.17 LED5.2
N$10
  Top 0.254: R8.1 61.21,93.22 61.21,90.17 LED3.2
N$11
  Top 0.254: LED4.1 53.59,88.14 53.59,81.79 T5.1
N$12
  Top 0.254: R11.1 39.12,93.22 39.12,90.42 LED6.2
N$13
  Top 0.254: R12.1 119.2,3.15 LED7.2
N$14
  Top 0.254: IC2.10 90.41,69.8 96.13,69.8 IC3.2
N$15
  Top 0.254: R13.1 111.8,3.05 LED8.2
N$16
  Top 0.254: LED5.1 46.48,88.14 46.48,81.79 T6.1
N$17
  Top 0.254: LED6.1 39.12,88.39 39.12,82.04 T7.1
N$18
  Top 0.254: LED8.1 115.61,1.14 123.6,1.14 124.4,1.94 124.4,27.9 129.2,32.7 129.2,39.2 130.27,40.27 133.06,40.27 IC4.22
N$19
  Bottom 0.254: JP3.2 47.37,30.39 R25.1
N$20
  Top 0.254: IC4.17 134.62,36.98 136.39,35.21 C4.2
N$21
  Top 0.254: JP6.2 133.73,25.8 133.73,27.1 131,29.83 131,35.8 131.53,36.33 IC4.16
N$22
  Top 0.254: JP6.3 136.37,27.63 133.1,30.9 IC4.15
N$23
  Top 0.254: T8.1 23.23,79.45 23.23,85.34 R17.1 23.43,85.55 28.71,90.83 28.71,95.5 R20.2
N$24
  Top 0.254: T8.2 21.8,81.48 17.94,85.34 R21.1
N$25
  Top 0.254: T1.1 86.32,42.69 R1.1 89.5,40.42 LS1.2
N$26
  Top 0.254: T9.2 31.76,81.69 31.76,82.5 28.91,85.34 R20.1
N$27
  Top 0.254: R22.2 19.42,70 30.83,70 JP2.2
N$28
  Top 0.254: R24.1 LED9.2
N$30
  Top 0.254: R19.1 34,80.53 33.57,80.09 33.56,80.09 T9.1 33.13,79.54 JP1.1
N$31
  Bottom 0.254: JP4.1 40.87,30.99 R26.1
N$32
  Top 0.254: IC2.5 83.51,69.83 R14.1 74.8,66.42 R18.2
POT_LINEAR
  Top 0.254: IC1.4 71.37,61.47 71.37,47.9 70.3,46.83 70.3,44.59 61.21,35.5 61.21,27.69 68.5,20.4 83.48,20.4 85.85,18.03 J1.A2
POWER
  Top 0.254: IC2.6 IC2.7 83.69,67.29 79.9,63.5 78,63.5 76.67,62.17 IC1.2
RX_LORA  (via drill 0.35)
  Top 0.254: ICS1.UARTRX 124.96,77.36 v123.7,76.1
  Bottom 0.254: R23.1 26.38,67.6 R22.1 28.18,75 93.7,75 94.9,76.2 123.6,76.2 v123.7,76.1
RX_UART
  Bottom 0.254: JP1.2 41.11,67.56 IC1.16
SONAR_ADC1
  Top 0.254: IC1.6 66.29,61.47 66.29,50.04 62.68,46.43 62.68,38.23 60.41,35.95 60.41,20.62 62.99,18.03 J2.A1
SONAR_ADC2  (via drill 0.35)
  Top 0.254: v69.79,48.05 69.79,59.5 IC1.5
  Bottom 0.254: J5.A1 77.98,18.03 77.98,26.59 70.8,33.77 70.8,44.9 70.4,45.3 70.4,47.44 v69.79,48.05
TEMP
  Top 0.254: IC2.8 90.41,64.85 R16.1 94.35,60.35 88.5,54.5 79.1,54.5 74.13,59.47 IC1.3
TX_LORA
  Bottom 0.254: ICS1.UARTTX 151.3,74.8 147.9,74.8 125.4,97.3 19.4,97.3 17.8,95.7 R21.2
TX_UART
  Top 0.254: IC1.15 41.98,59.9 38.3,59.9 37.3,60.9 37.3,66.07 JP2.1
UART_RX_2  (via drill 0.35)
  Top 0.254: IC4.1 126,44.23 119.97,44.23 v119.8,44.4
  Bottom 0.254: v119.8,44.4 102.6,44.4 97.7,49.3 51.2,49.3 48.73,46.83 IC1.28
UART_TX_2  (via drill 0.35)
  Top 0.254: IC4.5 123.62,41.52 123.1,41 v122.2,41
  Bottom 0.254: v122.2,41 122.2,44.4 120.8,45.8 102.9,45.8 98.3,50.4 50.45,50.4 IC1.27
V+  (via drill 0.35)
  Top 0.254: R13.2 112.4,10.05 | JP6.1 130.1,26.89 130.1,37.4 130.97,38.27 IC4.19 IC4.20 141.88,38.92 141.95,39 | IC4.4 118.6,42.17 | LS1.1 96.48,41.68 R1.2 | R26.2 R25.2 49.78,39.6 56.21,39.6 58.7,42.09 C2.1 | J6.2 89.3,84.4 86.45,81.55 R24.2 83.33,76.58 R14.2 80.1,74.2 83.2,71.1 IC2.4 86.4,71.1 v87.7,69.8 | 19.77,32.77 21.59,30.95 21.59,26.92 S2.A1 | S3.A1 21.59,38.86 19.77,37.04 19.77,32.77 | 5.13,36.88 5.08,36.83 2.6,36.83 | 5.13,36.88 5.59,37.34 5.59,39.12 5.84,39.37 7.11,39.37 7.37,39.12 9.91,39.12 S4.A1 | C1.1 53.34,66.29 53.1,66.4 | 19.77,32.77 9.24,32.77 5.13,36.88 | C5.1 141.95,39 | 141.95,39 141.95,33.94 C3.2
  Top 0.61: 34.17,95.51 R19.2 | 25.1,97.9 23.4,96.2 R17.2 | 4.8,60.41 JP7.5 | 46.5,95.35 49.46,95.35 51.5,93.31 51.5,77.4 53.1,75.8 53.1,66.4 53.81,65.69 IC1.11 53.81,58.69 58.89,53.61 IC1.32 58.89,42.59 C2.1
  Top 1.016: 91,93 85,93 82.6,95.4 77.45,95.4 R6.2 69.3,95.35 R7.2 69.1,95.35 R8.2 R9.2 46.5,95.35 R10.2 39.1,95.25 R11.2 34.33,95.35 34.17,95.51 | 91,93 113.2,93 117.25,88.95 117.25,43.7 | R19.2 31.78,97.9 25.1,97.9 16.93,97.9 5.4,86.37 5.4,74.8 | 5.4,74.8 5.4,74.69 6.5,73.59 JP5.5 | 5.4,74.8 2.6,72 2.6,62.61 | 4.8,60.41 2.6,62.61 | 2.6,62.61 2.6,36.83 2.6,27.62 4.52,25.7 R2.2 | J2.B1 J5.B1 J1.B1 92,10.2 112.55,10.2 | J6.2 J6.4 89.3,91.3 91,93 | 118.6,39.6 118.6,13.85 114.95,10.2 | 118.6,39.6 118.6,42.17 118.6,42.35 117.25,43.7 | 112.55,10.2 112.4,10.05 | 114.95,10.2 112.55,10.2 | U1.3 118.1,39.1 118.6,39.6 | 117.25,43.7 116.15,42.6 C6.1 | R12.2 115.3,9.85 114.95,10.2
  Bottom 0.254: JP6.1 117.59,12 90.2,12 J1.B1 89.4,29.6 LS1.1 | IC3.1 94.77,65.8 89.1,65.8 87.8,67.1 87.8,69.8 v87.7,69.8
  Bottom 1.016: J5.B1 74.5,26.45 73.25,27.7 D1.C

### Text on the board
tNames: 1k | 1k | 1k | 1k | 1k | 1k | POWER 5V | + | + | + | + | + | + | - | - | - | - | - | - | SONAR 2 / DATA | SONAR 1 / DATA | GATE / DOWN | GATE / UP | RX DATA | POWER / ERROR | C | E | C | E | C | E | C | E | C | E | C | E | B | B | + | - | ON | E | C | E | C | + | - | B | B | B | B | B | B | 1k | RX | TEMP | - | TX | 0.1uF | - | + | ICSP | + | MCLR | VDD | VSS | PGD | PGC | DSPIC30F4011 | N/C | FT232 | 0.1uF | 10uF | GATE UP | - | + | GATE DOWN | 0.1uF | B | 1k | 1k | + | - | E | C | B | E | C | 1uF | 1uF | MCLR | ZERO | I2C | I2C | 10k | 1k | + | - | + | - | buzzer | 10uF | - | D- | Vcc | D+ | Gnd | 390 | 390 | I2C | POT | I2C | GND | 5V | SONAR | GND | GND | 5V | 5V | SONAR | SONAR | FAN | 8-BIT | SCL | SDA | ADC | ADC | ADC | LINEAR | - | COMMUNICATION | I2C | + | + | - | SONAR 1 | SONAR 2 | RX LED | TX LED
bNames: RTC DS3231 | 32K | SQW | SCL | SDA | Vcc | Gnd